# Altium schematic sheet SD_Card.SchDoc
size A4; CompanyName: Technische Hochschule Nürnberg Georg Simon Ohm; Organization: UltraZohm; Address1: Kesslerplatz 12; Address2: 90489 Nürnberg; Address3: GERMANY; SheetNumber: 29; Website: www.ultrazohm.com
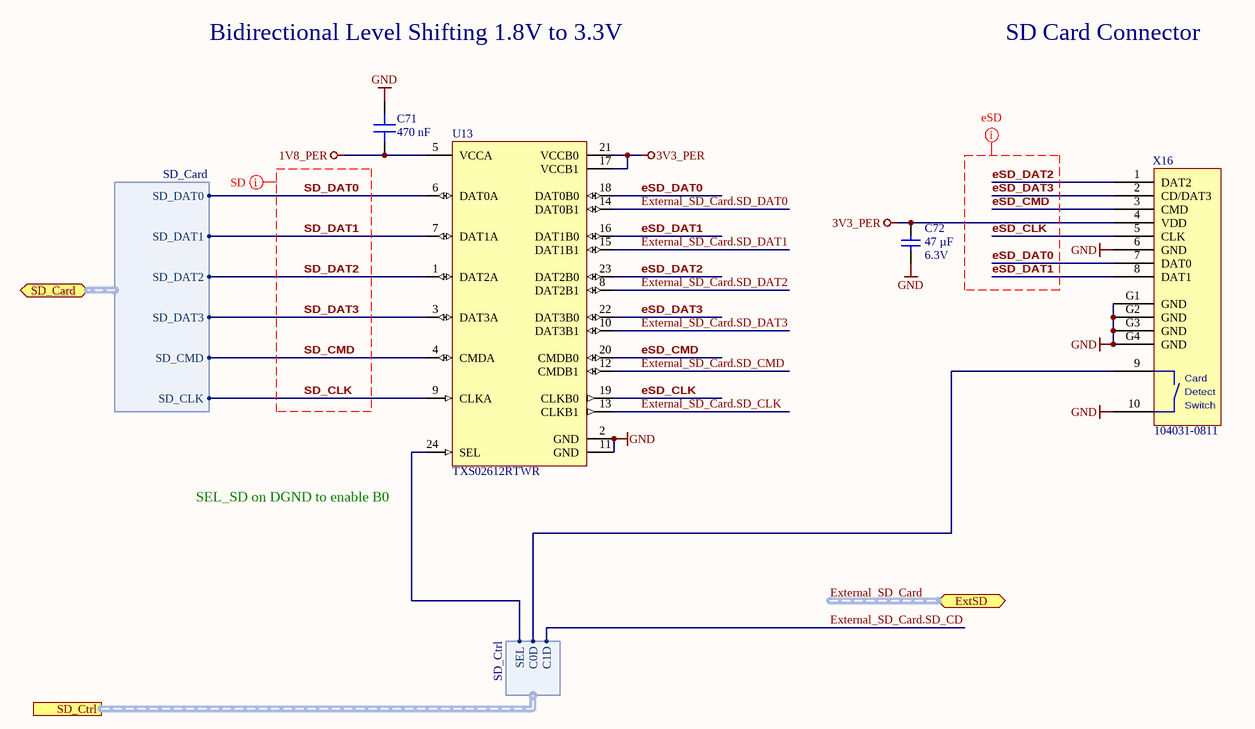
[diagram p0: SD_Card.SchDoc]

## Parts
C71  470 nF  [C_0603_TE]
C72  47 µF  Voltage: 6.3V  [C_0805_TE]
U13  TXS02612RTWR  [QFN50P400X400X80-25N-255]
X16  104031-0811  [104031-0811]

## Ports
ExtSD (bidir, harness ExtSD), SD_Card (bidir, harness SD_Card), SD_Ctrl (harness SD_CTRL)

## Harnesses
SD_Card: SD_DAT0, SD_DAT1, SD_DAT2, SD_DAT3, SD_CMD, SD_CLK
SD_Ctrl: SEL, C0D, C1D

## Nets
1V8_PER: C71.1 U13.5(VCCA)
3V3_PER: C72.2 U13.17(VCCB1) U13.21(VCCB0) X16.4(VDD)
GND: C71.2 C72.1 U13.2(GND) U13.11(GND) X16.6(GND) X16.10(CDSW) X16.G1(GND) X16.G2(GND) X16.G3(GND) X16.G4(GND)
eSD_CLK: U13.19(CLKB0) X16.5(CLK)
eSD_CMD: U13.20(CMDB0) X16.3(CMD)
eSD_DAT0: U13.18(DAT0B0) X16.7(DAT0)
eSD_DAT1: U13.16(DAT1B0) X16.8(DAT1)
eSD_DAT2: U13.23(DAT2B0) X16.1(DAT2)
eSD_DAT3: U13.22(DAT3B0) X16.2(CD/DAT3)
External_SD_Card.SD_CD: port SD_Ctrl.C1D
External_SD_Card.SD_CLK: U13.13(CLKB1)
External_SD_Card.SD_CMD: U13.12(CMDB1)
External_SD_Card.SD_DAT0: U13.14(DAT0B1)
External_SD_Card.SD_DAT1: U13.15(DAT1B1)
External_SD_Card.SD_DAT2: U13.8(DAT2B1)
External_SD_Card.SD_DAT3: U13.10(DAT3B1)
SD_CLK: U13.9(CLKA) ; port SD_Card.SD_CLK
SD_CMD: U13.4(CMDA) ; port SD_Card.SD_CMD
SD_DAT0: U13.6(DAT0A) ; port SD_Card.SD_DAT0
SD_DAT1: U13.7(DAT1A) ; port SD_Card.SD_DAT1
SD_DAT2: U13.1(DAT2A) ; port SD_Card.SD_DAT2
SD_DAT3: U13.3(DAT3A) ; port SD_Card.SD_DAT3
NetU13_24: U13.24(SEL) ; port SD_Ctrl.SEL
NetX16_9: X16.9(CDSW) ; port SD_Ctrl.C0D

## Buses and harness runs
harness External_SD_Card = port ExtSD

## Layout directives
net class eSD: eSD_CLK, eSD_CMD, eSD_DAT0, eSD_DAT1, eSD_DAT2, eSD_DAT3
net class SD: SD_CLK, SD_CMD, SD_DAT0, SD_DAT1, SD_DAT2, SD_DAT3

## Notes on the sheet
- Bidirectional Level Shifting 1.8V to 3.3V
- SD Card Connector
- SEL_SD on DGND to enable B0
- Title
- Revision:
- Design Engineer:
- Date:
- Project:
- Sheet
- of
- (in symbol 104031-0811) Card; Detect; Switch

## Library data of the parts
C71 = CL10A474KB8NNNC: Capacitor 0603, 50 VDC, 470 nF, X5R; Manufacturer: Samsung Electro-Mechanics; Tolerance: 10 %; Created from: AGeiger; Voltage Rating: 50 VDC; Value: 470 nF; Manufacturer Part Number: CL10A474KB8NNNC; PartID: 103; Created On: 22/08/2022 14:44:45; Device Package: 0603; Mounting Type: SMD; Last Updated: 22/04/2025 15:48:45; ComponentLink1Description: Datasheet; ComponentLink1URL: https://datasheet.lcsc.com/lcsc/1810191213_Samsung-Electro-Mechanics-CL10A474KB8NNNC_C170149.pdf; Component Type: Capacitor 0603; Operating Temperature: -55 - 85°C; Series: X5R; Supplier 1: LCSC; Supplier Part Number 1: C170149; Supplier 2: Mouser; Supplier Part Number 2: 187-CL10A474KB8NNNC; Type: Capacitor; Live Cycle Status: 1; LCSC Part Number: C170149
C72 = UZgen_C_0805_47uF_6.3V_X7R: Generic capacitor; Manufacturer: UZgen; Tolerance: 10 %; Created from: UZgenTool; Value: 47 µF; Technology: X7R; Manufacturer Part Number: UZgen_C_0805_47uF_6.3V_X7R; PartID: 5223; Created On: 02/08/2024 11:18:30; Device Package: 0805; Mounting Type: SMD; Last Updated: 02/08/2024 11:18:30
U13 = TXS02612RTWR: SDIO Port Expander with voltage level Translation; Manufacturer: Texas Instruments; Created from: MGremer; Manufacturer Part Number: TXS02612RTWR; PartID: 2; Created On: 01/12/2020 16:10:37; ComponentLink1Description: Datasheet; ComponentLink1URL: https://www.ti.com/lit/ds/sces682c/sces682c.pdf?ts=1606759646974&ref_url=https%253A%252F%252Fwww.google.com%252F; Component Type: Port Expander; Device Package: QFN; Last Updated: 04/09/2024 15:51:15; Mounting Type: QFN24; Supplier 1: Farnell; Supplier Part Number 1: 2335617RL; Supplier 2: Mouser; Supplier Part Number 2: 595-TXS02612RTWR; Supplier 3: Digi-Key; Supplier Part Number 3: 296-23869-1-ND; Type: Port Expander; Live Cycle Status: 1; Stock number: not stored; Supplier 4: LCSC; Supplier Part Number 4: C140276; LCSC Part Number: C140276
X16 = 104031-0811: microSD Memory Card Connector with detect switch; Manufacturer: Molex; Created from: MGremer; Manufacturer Part Number: 104031-0811; PartID: 1; Created On: 30/11/2020 14:53:05; ComponentLink1Description: Homepage; ComponentLink1URL: https://www.molex.com/molex/products/part-detail/memory_card_socket/1040310811; Component Type: SD Card Connector; Device Package: mircoSD; Last Updated: 09/07/2024 09:00:58; Mounting Type: SMD; Supplier 1: Farnell; Supplier Part Number 1: 2466891; Supplier 2: Mouser; Supplier Part Number 2: 538-104031-0811; Supplier 3: Digi-Key; Supplier Part Number 3: WM6357CT-ND; Supplier 4: LCSC; Supplier Part Number 4: C585350; Type: SD Card Connector; Live Cycle Status: 1; LCSC Part Number: C585350; Stock number: not stored